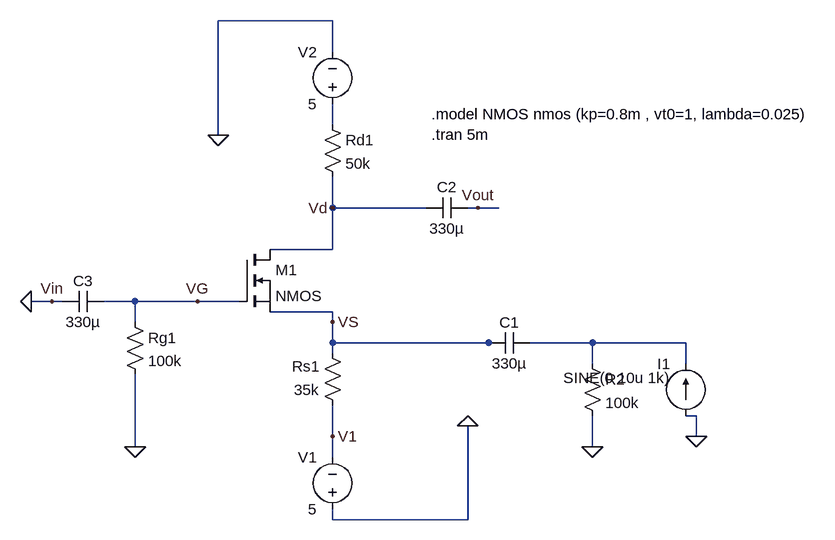
[diagram p0: schematic Draft6.asc]
Draft6.asc, the LTspice schematic file:
Version 4
SHEET 1 924 680
WIRE 176 -240 0 -240
WIRE 176 -192 176 -240
WIRE 176 -80 176 -112
WIRE 0 -64 0 -240
WIRE 176 48 176 0
WIRE 320 48 176 48
WIRE 400 48 384 48
WIRE 432 48 400 48
WIRE 144 112 80 112
WIRE 176 112 176 48
WIRE 176 112 144 112
WIRE -256 192 -288 192
WIRE -240 192 -256 192
WIRE -128 192 -176 192
WIRE -32 192 -128 192
WIRE 0 192 -32 192
WIRE 32 192 0 192
WIRE 176 208 80 208
WIRE -128 224 -128 192
WIRE 176 224 176 208
WIRE 176 256 176 224
WIRE 416 256 176 256
WIRE 432 256 416 256
WIRE 576 256 480 256
WIRE 720 256 576 256
WIRE 176 272 176 256
WIRE 576 288 576 256
WIRE 720 288 720 256
WIRE 176 368 176 352
WIRE 736 368 720 368
WIRE 176 400 176 368
WIRE 736 400 736 368
WIRE -128 416 -128 304
WIRE 576 416 576 368
WIRE 176 432 176 400
WIRE 176 528 176 512
WIRE 384 528 384 384
WIRE 384 528 176 528
FLAG -128 416 0
FLAG 384 384 0
FLAG 176 224 VS
FLAG -32 192 VG
FLAG 176 400 V1
FLAG 0 -64 0
FLAG -256 192 Vin
FLAG 400 48 Vout
FLAG 176 48 Vd
FLAG -288 192 0
FLAG 576 416 0
FLAG 736 400 0
DATAFLAG 0 192 "$"
DATAFLAG 176 368 "$"
DATAFLAG 144 112 "$"
DATAFLAG 176 208 "$"
SYMBOL res 192 368 R180
WINDOW 0 36 76 Left 2
WINDOW 3 36 40 Left 2
SYMATTR InstName Rs1
SYMATTR Value 35k
SYMBOL res -144 208 R0
SYMATTR InstName Rg1
SYMATTR Value 100k
SYMBOL nmos 32 112 R0
SYMATTR InstName M1
SYMBOL voltage 176 528 R180
WINDOW 0 24 96 Left 2
WINDOW 3 24 16 Left 2
SYMATTR InstName V1
SYMATTR Value 5
SYMBOL res 160 -96 R0
SYMATTR InstName Rd1
SYMATTR Value 50k
SYMBOL voltage 176 -96 R180
WINDOW 0 24 96 Left 2
WINDOW 3 24 16 Left 2
SYMATTR InstName V2
SYMATTR Value 5
SYMBOL cap 480 240 R90
WINDOW 0 0 32 VBottom 2
WINDOW 3 32 32 VTop 2
SYMATTR InstName C1
SYMATTR Value 330µ
SYMBOL cap 384 32 R90
WINDOW 0 0 32 VBottom 2
WINDOW 3 32 32 VTop 2
SYMATTR InstName C2
SYMATTR Value 330µ
SYMBOL cap -176 176 R90
WINDOW 0 0 32 VBottom 2
WINDOW 3 32 32 VTop 2
SYMATTR InstName C3
SYMATTR Value 330µ
SYMBOL res 560 272 R0
SYMATTR InstName R2
SYMATTR Value 100k
SYMBOL current 720 368 R180
WINDOW 0 24 80 Left 2
WINDOW 3 24 58 Left 2
SYMATTR InstName I1
SYMATTR Value SINE(0 10u 1k)
TEXT 328 -96 Left 2 !.model NMOS nmos (kp=0.8m , vt0=1, lambda=0.025) \n.tran 5m

The netlist it stands for:
* Draft6.asc
Rs1 V1 VS 35k
Rg1 VG 0 100k
M1 Vd VG VS VS NMOS
V1 0 V1 5
Rd1 N001 Vd 50k
V2 N001 0 5
C1 N002 VS 330µ
C2 Vout Vd 330µ
C3 VG 0 330µ
R2 N002 0 100k
I1 0 N002 SINE(0 10u 1k)
.model NMOS NMOS
.model PMOS PMOS
.lib standard.mos
.model NMOS nmos (kp=0.8m , vt0=1, lambda=0.025)
.tran 5m
.backanno
.end